# Altium schematic sheet 03.SchDoc (part 12 of 12)

# Altium schematic sheet 03.SchDoc (continued)
size A3; CompanyName (continued): ; Address3: 油平259; Phone: 042-558-0141
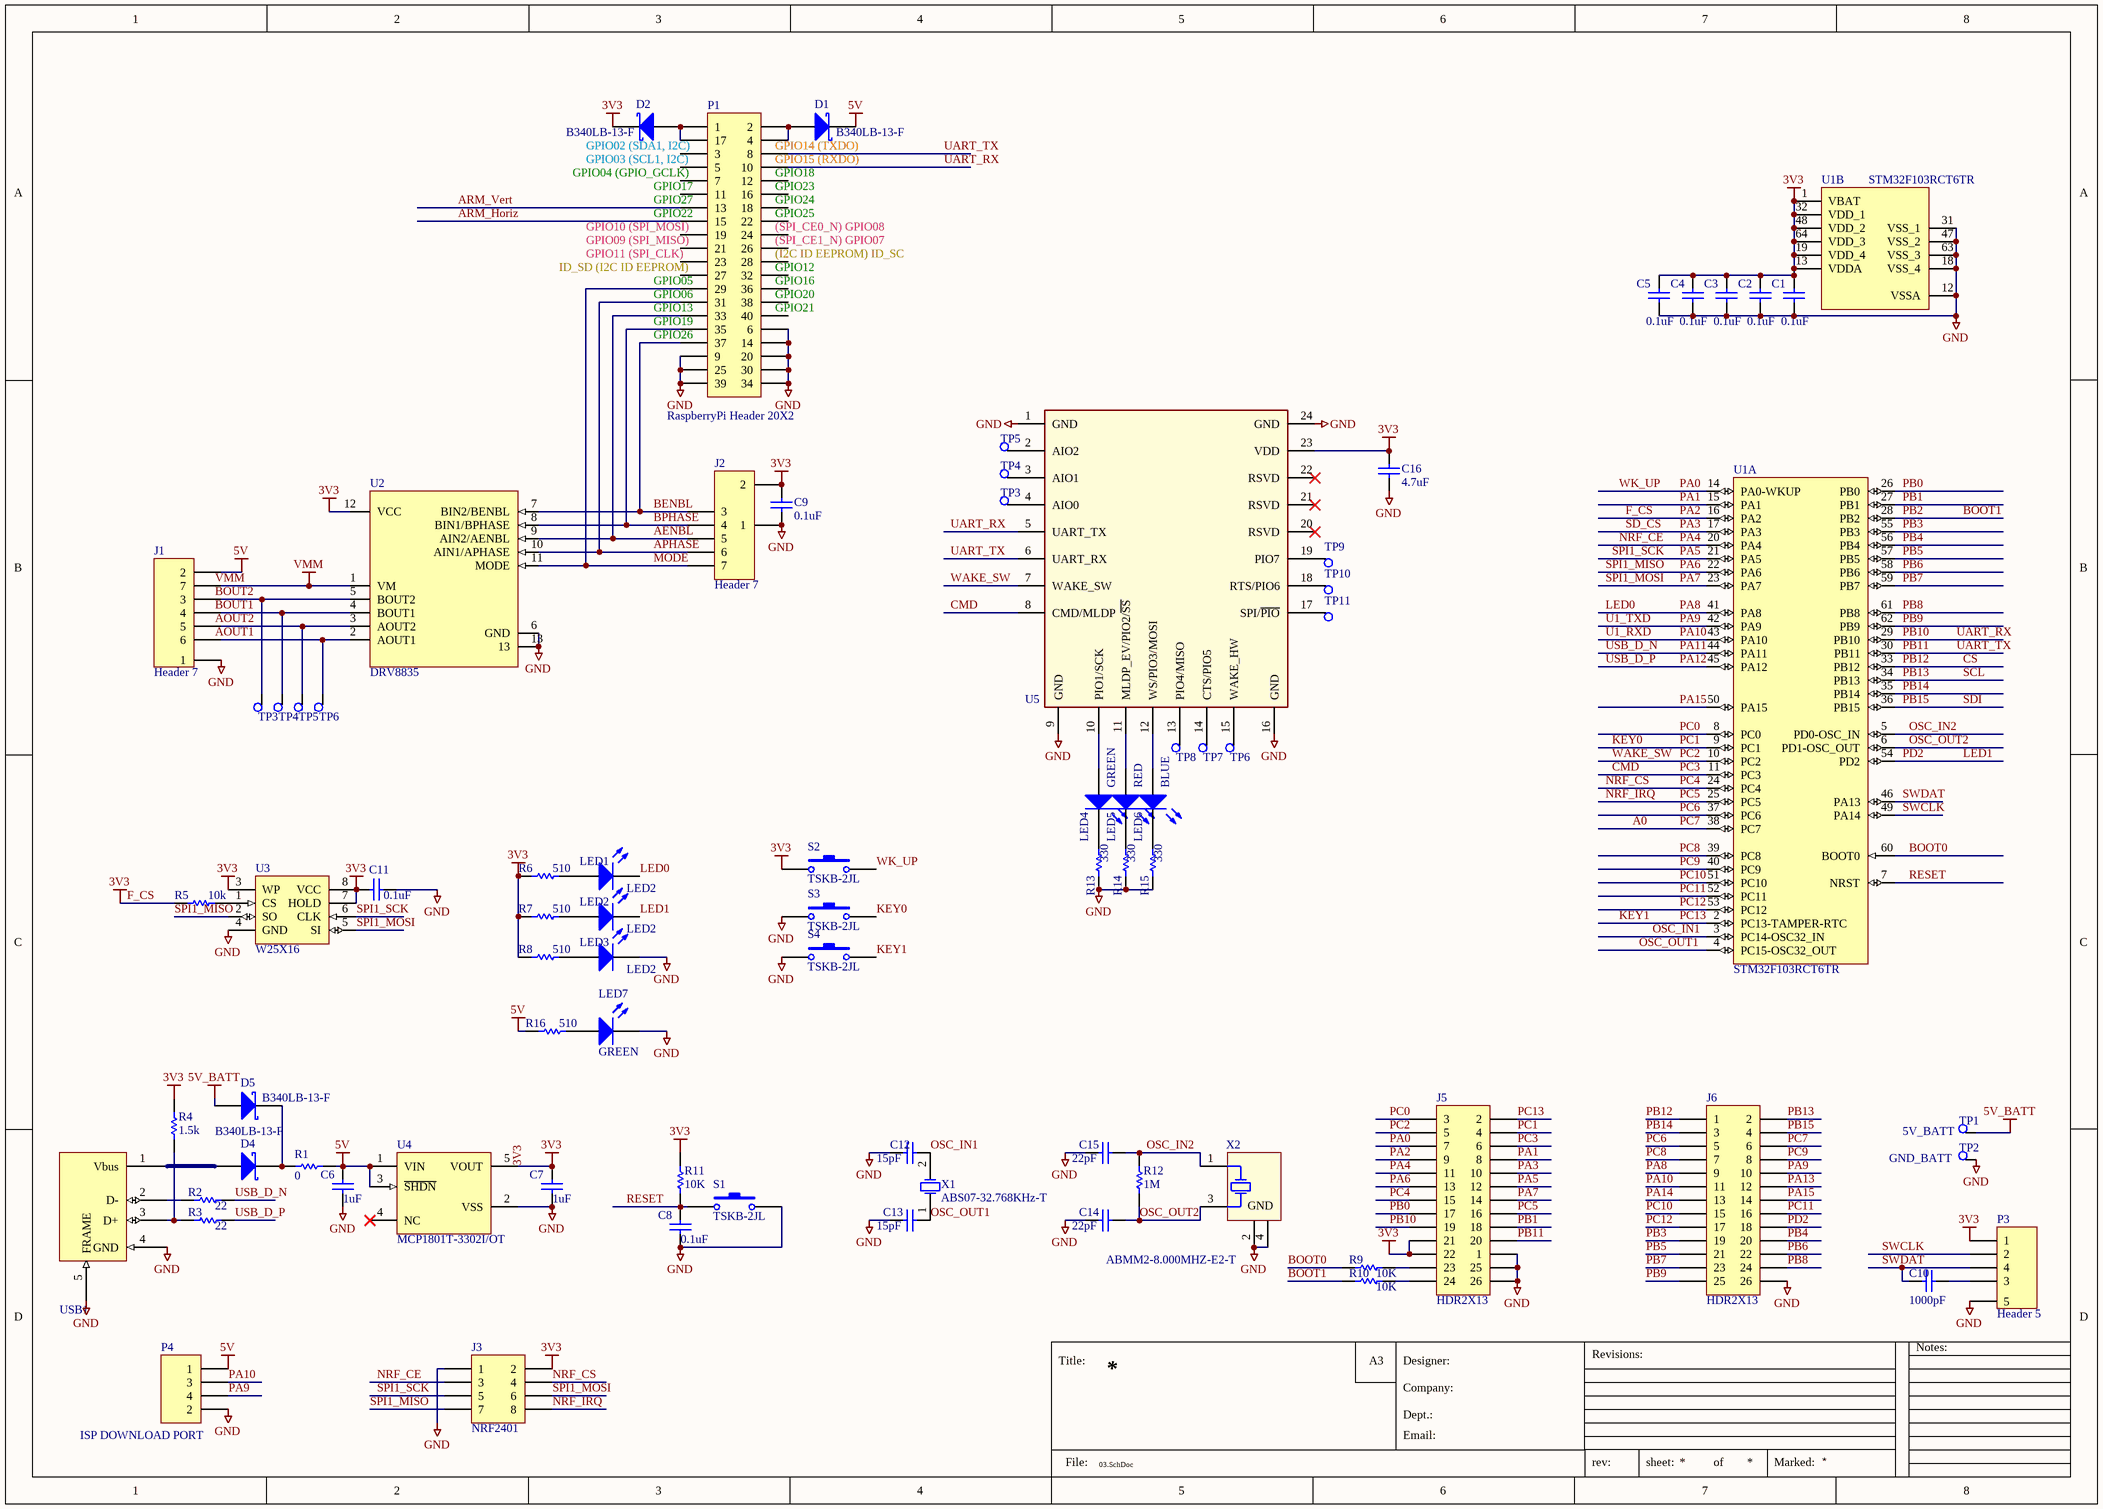
[diagram p0: 03.SchDoc]

## Parts
(Parts that share a designator on the sheet are numbered #1, #2 ... from top to bottom, then left to right.)
C1  0.1uF  [1608[0603]]
C2  0.1uF  [1608[0603]]
C3  0.1uF  [1608[0603]]
C4  0.1uF  [1608[0603]]
C5  0.1uF  [1608[0603]]
C6  1uF  [1608[0603]]
C7  1uF  [1608[0603]]
C8  0.1uF  [1608[0603]]
C9  0.1uF  [1608[0603]]
C10  1000pF  [1608[0603]]
C11  0.1uF  [1608[0603]]
C12  15pF  [1608[0603]]
C13  15pF  [1608[0603]]
C14  22pF  [1608[0603]]
C15  22pF  [1608[0603]]
C16  4.7uF  [1608[0603]]
D1  B340LB-13-F  [DIOM4336X25N]
D2  B340LB-13-F  [DIOM4336X25N]
D4  B340LB-13-F  [DIOM4336X25N]
D5  B340LB-13-F  [DIOM4336X25N]
J1  Header 7  [HDR1X7]
J2  Header 7  [HDR1X7]
J3  NRF2401  [HDR2X4]
J5  HDR2X13  [HDR2X13]
J6  HDR2X13  [HDR2X13]
LED1  LED2  [0603_A]
LED2  LED2  [0603_A]
LED3  LED2  [0603_A]
LED4  GREEN  [0603_A]
LED5  RED  [0603_A]
LED6  BLUE  [0603_A]
LED7  GREEN  [0603_A]
P1  RaspberryPi Header 20X2  [HDR2X20]
P3  Header 5  [HDR1X5]
P4  ISP DOWNLOAD PORT  [HDR1X4]
R1  0  [1608[0603]]
R2  22  [1608[0603]]
R3  22  [1608[0603]]
R4  1.5k  [1608[0603]]
R5  10k  [1608[0603]]
R6  510  [1608[0603]]
R7  510  [1608[0603]]
R8  510  [1608[0603]]
R9  10K  [1608[0603]]
R10  10K  [1608[0603]]
R11  10K  [1608[0603]]
R12  1M  [1608[0603]]
R13  330  [1608[0603]]
R14  330  [1608[0603]]
R15  330  [1608[0603]]
R16  510  [1608[0603]]
S1  TSKB-2JL  [TSKB-2JL]
S2  TSKB-2JL  [TSKB-2JL]
S3  TSKB-2JL  [TSKB-2JL]
S4  TSKB-2JL  [TSKB-2JL]
TP1  5V_BATT  [PAD1]
TP2  GND_BATT  [PAD1]
TP3#1  (no value)  [PAD1]
TP3#2  (no value)  [PAD1]
TP4#1  (no value)  [PAD1]
TP4#2  (no value)  [PAD1]
TP5#1  (no value)  [PAD1]
TP5#2  (no value)  [PAD1]
TP6#1  (no value)  [PAD1]
TP6#2  (no value)  [PAD1]
TP7  (no value)  [PAD1]
TP8  (no value)  [PAD1]
TP9  (no value)  [PAD1]
TP10  (no value)  [PAD1]
TP11  (no value)  [PAD1]
U1  STM32F103RCT6TR  [STM-LQFP64_N]  (parts A,B of 2)
U2  DRV8835
U3  W25X16  [SOIC-SSCODE_SOIC127P790X216-8N]
U4  MCP1801T-3302I/OT  [SOT-23-OT5_M]
U5  RN4020 MODULE-24  [RN4020 MODULE-24]  (value not drawn)
USB1  USB002  [USB/SM0.8-6H5]  (value not drawn)
X1  ABS07-32.768KHz-T  [ABRA-ABS07-2_V]
X2  ABMM2-8.000MHZ-E2-T  [ABRA-ABMM2-4_V]

## Nets
3V3: C1.2 C2.2 C3.2 C4.2 C5.2 C7.2 C9.1 C11.2 C16.1 D2.2(K) J2.2 J3.2 J5.9 J5.21 J5.22 P3.1 R4.1 R5.2 R6.2 R7.2 R8.2 R11.1 S2.1 U1.1(VBAT) U1.13(VDDA) U1.16(PA2) U1.19(VDD_4) U1.32(VDD_1) U1.48(VDD_2) U1.64(VDD_3) U2.12(VCC) U3.3(WP) U3.7(HOLD) U3.8(VCC) U4.5(VOUT) U5.23(VDD)  [also labelled F_CS, PA2]
5V: C6.2 D1.2(K) J1.2 P4.1 R1.1 R16.2 U4.1(VIN) U4.3(~{SHDN})
5V_BATT: D5.1(A) TP1.1
GND: C1.1 C2.1 C3.1 C4.1 C5.1 C6.1 C7.1 C8.1 C9.2 C11.1 C12.2 C13.2 C14.2 C15.2 C16.2 J1.1 J2.1 J3.1 J5.1 J5.25 J5.26 J6.26 LED3.1(K) LED7.1(K) P1.6 P1.9 P1.14 P1.20 P1.25 P1.30 P1.34 P1.39 P3.5 P4.2 R13.2 R14.2 R15.2 S1.2 S3.1 S4.1 TP2.1 U1.12(VSSA) U1.18(VSS_4) U1.31(VSS_1) U1.47(VSS_2) U1.63(VSS_3) U2.6(GND) U2.13 U3.4(GND) U4.2(VSS) U5.1(GND) U5.9(GND) U5.16(GND) U5.24(GND) USB1.4(GND) USB1.5(FRAME) X2.2(GND) X2.4(GND)
VMM: J1.7 U2.1(VM)
A0: J6.6 U1.38(PC7)  [also labelled PC7]
AENBL: J2.5 P1.33 U2.9(AIN2/AENBL)
APHASE: J2.6 P1.31 U2.10(AIN1/APHASE)
ARM_Horiz: P1.15
ARM_Vert: P1.13
BENBL: J2.3 P1.37 U2.7(BIN2/BENBL)
BOOT0: R9.1 U1.60(BOOT0)
BOOT1: R10.1 U1.28(PB2)  [also labelled PB2]
BPHASE: J2.4 P1.35 U2.8(BIN1/BPHASE)
CMD: J5.6 U1.11(PC3) U5.8(CMD/MLDP)  [also labelled PC3]
CS: J6.1 U1.33(PB12)  [also labelled PB12]
KEY0: J5.4 S3.2 U1.9(PC1)  [also labelled PC1]
KEY1: J5.2 S4.2 U1.2(PC13-TAMPER-RTC)  [also labelled PC13]
LED0: J6.9 LED1.1(K) U1.41(PA8)  [also labelled PA8]
LED1: J6.18 LED2.1(K) U1.54(PD2)  [also labelled PD2]
MODE: J2.7 P1.29 U2.11(MODE)
NRF_CE: J3.3 J5.11 U1.20(PA4)  [also labelled PA4]
NRF_CS: J3.4 J5.15 U1.24(PC4)  [also labelled PC4]
NRF_IRQ: J3.8 J5.16 U1.25(PC5)  [also labelled PC5]
OSC_IN1: C12.1 U1.3(PC14-OSC32_IN) X1.2(X2)
OSC_IN2: C15.1 R12.1 U1.5(PD0-OSC_IN) X2.1(X1)
OSC_OUT1: C13.1 U1.4(PC15-OSC32_OUT) X1.1(X1)
OSC_OUT2: C14.1 R12.2 U1.6(PD1-OSC_OUT) X2.3(X2)
PA0: J5.7 S2.2 U1.14(PA0-WKUP)  [also labelled WK_UP]
PA1: J5.8 U1.15(PA1)
PA3: J5.10 U1.17(PA3)  [also labelled SD_CS]
PA5: J3.5 J5.12 U1.21(PA5) U3.6(CLK)  [also labelled SPI1_SCK]
PA6: J3.7 J5.13 U1.22(PA6) U3.2(SO)  [also labelled SPI1_MISO]
PA7: J3.6 J5.14 U1.23(PA7) U3.5(SI)  [also labelled SPI1_MOSI]
PA9: J6.10 P4.4 U1.42(PA9)  [also labelled U1_TXD]
PA10: J6.11 P4.3 U1.43(PA10)  [also labelled U1_RXD]
PA11: R2.1 U1.44(PA11)  [also labelled USB_D_N]
PA12: R3.1 U1.45(PA12)  [also labelled USB_D_P]
PA13: J6.12
PA14: J6.13
PA15: J6.14 U1.50(PA15)
PB0: J5.17 U1.26(PB0)
PB1: J5.18 U1.27(PB1)
PB3: J6.19 U1.55(PB3)
PB4: J6.20 U1.56(PB4)
PB5: J6.21 U1.57(PB5)
PB6: J6.22 U1.58(PB6)
PB7: J6.23 U1.59(PB7)
PB8: J6.24 U1.61(PB8)
PB9: J6.25 U1.62(PB9)
PB10: J5.19 P1.10 U1.29(PB10) U5.5(UART_TX)  [also labelled UART_RX]
PB11: J5.20 P1.8 U1.30(PB11) U5.6(UART_RX)  [also labelled UART_TX]
PB13: J6.2 U1.34(PB13)  [also labelled SCL]
PB14: J6.3 U1.35(PB14)
PB15: J6.4 U1.36(PB15)  [also labelled SDI]
PC0: J5.3 U1.8(PC0)
PC2: J5.5 U1.10(PC2) U5.7(WAKE_SW)  [also labelled WAKE_SW]
PC6: J6.5 U1.37(PC6)
PC8: J6.7 U1.39(PC8)
PC9: J6.8 U1.40(PC9)
PC10: J6.15 U1.51(PC10)
PC11: J6.16 U1.52(PC11)
PC12: J6.17 U1.53(PC12)
RESET: C8.2 R11.2 S1.1 U1.7(NRST)
SWCLK: P3.2 U1.49(PA14)
SWDAT: C10.1 P3.4 U1.46(PA13)
NetC10_2: C10.2 P3.3
NetD1_1: D1.1(A) P1.2 P1.4
NetD2_1: D2.1(A) P1.1 P1.17
NetD4_1: D4.1(A) USB1.1(Vbus)
NetD4_2: D4.2(K) D5.2(K) R1.2
NetJ1_3: J1.3 TP3#2.1 U2.5(BOUT2)
NetJ1_4: J1.4 TP4#2.1 U2.4(BOUT1)
NetJ1_5: J1.5 TP5#2.1 U2.3(AOUT2)
NetJ1_6: J1.6 TP6#1.1 U2.2(AOUT1)
NetJ5_23: J5.23 R9.2
NetJ5_24: J5.24 R10.2
NetLED1_2: LED1.2(A) R6.1
NetLED2_2: LED2.2(A) R7.1
NetLED3_2: LED3.2(A) R8.1
NetLED4_1: LED4.1(K) R13.1
NetLED4_2: LED4.2(A) U5.10(PIO1/SCK)
NetLED5_1: LED5.1(K) R14.1
NetLED5_2: LED5.2(A) U5.11(MLDP_EV/PIO2/~{SS})
NetLED6_1: LED6.1(K) R15.1
NetLED6_2: LED6.2(A) U5.12(WS/PIO3/MOSI)
NetR2_2: R2.2 USB1.2(D-)
NetR3_2: R3.2 R4.2 USB1.3(D+)
NetR5_1: R5.1 U3.1(CS)
NetTP3#1_1: TP3#1.1 U5.4(AIO0)
NetTP4#1_1: TP4#1.1 U5.3(AIO1)
NetTP5#1_1: TP5#1.1 U5.2(AIO2)
NetTP6#2_1: TP6#2.1 U5.15(WAKE_HW)
NetTP7_1: TP7.1 U5.14(CTS/PIO5)
NetTP8_1: TP8.1 U5.13(PIO4/MISO)
NetTP9_1: TP9.1 U5.19(PIO7)
NetTP10_1: TP10.1 U5.18(RTS/PIO6)
NetTP11_1: TP11.1 U5.17(SPI/~{PIO})

Not connected (* = marked no-connect by the designer): LED7 2(A); P1 3 5 7 11 12 16 18 19 21 22 23 24 26 27 28 32 36 38 40; R16 1; U4 4(NC)*; U5 20(RSVD)* 21(RSVD)* 22(RSVD)*

## Notes on the sheet
- GPIO04 (GPIO_GCLK)
- GPIO02 (SDA1, I2C)
- (near P1) GPIO03 (SCL1, I2C)
- GPIO14 (TXDO)
- (near P1) GPIO15 (RXDO)
- (near P1) GPIO18
- (near P1) GPIO09 (SPI_MISO)
- (near P1) GPIO10 (SPI_MOSI)
- (near P1) GPIO17
- (near P1) GPIO22
- (near P1) GPIO27
- (near P1) (SPI_CE1_N) GPIO07
- (near P1) (SPI_CE0_N) GPIO08
- (near P1) GPIO23
- (near P1) GPIO24
- (near P1) GPIO25
- (near P1) ID_SD (I2C ID EEPROM)
- (near P1) GPIO11 (SPI_CLK)
- (near P1) GPIO05
- (near P1) GPIO06
- (near P1) GPIO13
- (near P1) GPIO12
- (near P1) GPIO16
- (near P1) GPIO20
- (near P1) GPIO21
- (near P1) (I2C ID EEPROM) ID_SC
- (near P1) GPIO19
- (near P1) GPIO26
- Labels drawn without touching a wire or pin: AOUT1, AOUT2, BOUT1, BOUT2, VMM
- Title:
- A3
- Designer:
- Company:
- Revisions:
- Notes:
- Dept.:
- Email:
- File:
- rev:
- sheet:
- of
- Marked:

## Library data of the parts
C1-C16 = Cap: Capacitor; Published: 8-Jun-2000; LatestRevisionDate: 17-Jul-2002; LatestRevisionNote: Re-released for DXP Platform.; PackageReference: RAD-0.3; Publisher: Altium Limited; PackageDescription: Radial Cap, Thru-Hole; 2 Leads; 0.3 in Pin Spacing
  C1-C5 C8 C9 C11: Value: 0.1uF
  C6 C7: Value: 1uF
  C10: Value: 1000pF
  C12 C13: Value: 15pF
  C14 C15: Value: 22pF
  C16: Value: 4.7uF
D1 D2 D4 D5 = D Schottky: Schottky Diode; OTHER: SX34F @20; LatestRevisionDate: 17-Jul-2002; LatestRevisionNote: Re-released for DXP Platform.; PackageReference: SMB; Publisher: Altium Limited; Code_JEDEC: DO-214-AA
J1 J2 = Header 7: Header, 7-Pin; LatestRevisionDate: 17-Jul-2002; LatestRevisionNote: Re-released for DXP Platform.; Publisher: Altium Limited
J3 = Header 4X2: Header, 4-Pin, Dual row; LatestRevisionDate: 17-Jul-2002; LatestRevisionNote: Re-released for DXP Platform.; Publisher: Altium Limited
J5 J6 = MHDR2X13: Header, 13-Pin, Dual row; LatestRevisionDate: 17-Jul-2002; LatestRevisionNote: Re-released for DXP Platform.; Publisher: Altium Limited
LED1-LED7 = LED2: Typical RED, GREEN, YELLOW, AMBER GaAs LED; Published: 8-Jun-2000; LatestRevisionDate: 17-Jul-2002; LatestRevisionNote: Re-released for DXP Platform.; PackageVersion: Feb-2002; PackageReference: 3.2X1.6X1.1; Publisher: Altium Limited; PackageDescription: SM LED; 2 Flat Leads
P1 = Header 20X2: Header, 20-Pin, Dual row; LatestRevisionDate: 17-Jul-2002; LatestRevisionNote: Re-released for DXP Platform.; Publisher: Altium Limited
P3 = Header 5: Header, 5-Pin; LatestRevisionDate: 17-Jul-2002; LatestRevisionNote: Re-released for DXP Platform.; Publisher: Altium Limited
P4 = Header 4: Header, 4-Pin; LatestRevisionDate: 17-Jul-2002; LatestRevisionNote: Re-released for DXP Platform.; Publisher: Altium Limited
R1-R16 = Res1: Resistor; PARTS: AH-50W 10R; PRICE: 350; LatestRevisionDate: 17-Jul-2002; LatestRevisionNote: Re-released for DXP Platform.; PackageReference: AXIAL-0.3
  R1: Value: 0
  R2 R3: Value: 22
  R4: Value: 1.5k
  R5: Value: 10k
  R6-R8 R16: Value: 510
  R9-R11: Value: 10K
  R12: Value: 1M
  R13-R15: Value: 330
S1-S4 = SW-PB: Switch; Published: 24-Mar-1999; LatestRevisionDate: 17-Jul-2002; LatestRevisionNote: Re-released for DXP Platform.; PackageReference: SPST-2; Publisher: Altium Limited; PackageDescription: Switch; 2 Leads
TP1 TP2 TP3#1 TP3#2 TP4#1 TP4#2 TP5#1 TP5#2 TP6#1 TP6#2 TP7-TP11 = RAUND1
U1 = CMP-0237-00202-3: ARM Cortex-M3 32-bit MCU, 256 KB Flash, 48 KB Internal RAM, 51 I/Os, 64-pin LQFP, -40 to 85 degC, Tape and Reel; FLASH Size (Prog) (kB): 256; D/A Converter: 2x12-bit (2 Channel); Operating Frequency(F) (Processor speed) (MHz): 72; Internal RAM Size (kB): 48; I/Os (High Current): 51; A/D Converter: 3x12-bit (16 Channel); Supply Voltage(Vcc) min (V): 2; ComponentLink1Description: Manufacturer URL; ComponentLink2Description: Datasheet; ComponentLink3URL: http://www.st.com/st-web-ui/static/active/en/resource/technical/document/datasheet/DM00037051.pdf; ComponentLink2URL: http://www.st.com/st-web-ui/static/active/en/resource/technical/document/datasheet/CD00191185.pdf; PackageDescription: 64-Pin Low Profile Quad Flat Package, 10 x 10 mm Body, 0.5 mm Pitch; ComponentLink3Description: Package Specification; PackageReference: LQFP64; Core: ARM Cortex-M3; PartNumber: STM32F103RCT6TR; Mounting Technology: Surface Mount; ComponentLink1URL: http://www.st.com/web/en/home.html; Packing: Tape and Reel; DatasheetVersion: Rev. 8; PackageVersion: Rev. 4, 06/2013; PartId: 1
U4 = CMP-0136-00719-1: 150 mA, High PSRR, Low Quiescent Current LDO, 5-Pin SOT-23, Industrial Temperature, Tape and Reel; Code_IPC: SOT23-5; PackageVersion: revBB, Aug-2009; PackageReference: SOT-23-OT5; DatasheetVersion: revC, Jan-2009; PackageDescription: 5-Lead Plastic Small Outline Transistor (OT) [SOT-23]
X1 = CMP-0447-00001-2: Crystal, 32.768 kHz, 12.5 pF, -40 to 85 degC, SMD Low Profile 3.2 x 1.5 x 0.9 mm, Tape and Reel; Manufacturer: Abracon; Q Value (Type): 30000; Operation Mode: Flexural Mode (Tuning Fork); Shunt Capacitance (C0): 0.9 to 1.2 pF; Load Capacitance (CL): 12.5 pF; Frequency Tolerance @+25degC: +/- 20 ppm; Drive Level (Type): 0.1 uW; Equivalent Series Resistance (R1): 70 Kohm; Insulation Resistance (Min): 500 Mohm; ComponentLink3URL: http://www.abracon.com/Resonators/ABS07.pdf; PackageDescription: 2-Pin Hand Drawn, Body 3.2x1.5mm, Pitch 2.5mm; Operating Temperature: -40 to 85 degC; ComponentLink2URL: http://www.abracon.com/Resonators/ABS07.pdf; PackageReference: ABS07-2; ComponentLink3Description: Package Specification; ComponentLink1Description: Manufacturer URL; DatasheetVersion: 04.03.13; Mounting Technology: Surface Mount; ComponentLink2Description: Datasheet; ComponentLink1URL: http://www.abracon.com/; PartNumber: ABS07-32.768KHz-T; Packing: Tape and Reel; Frequency: 32.768 kHz
X2 = CMP-0277-00003-1: Ceramic Surface Mount Low Profile Quartz Crystal, 8 MHz, -20 to 70 degC, 4-Pin 6 x 3.6 x 1.2 mm SMD, RoHS, 1000pcs / Reel; Manufacturer: Abracon; ESR: 72 Ohm Max.; Frequency: 8 MHz; Shunt Capacitance C0: 7 pF Max.; Load Capacitance CL: 18 pF Typ.; ComponentLink3Description: Package Specification; PackageDescription: 4-Pin SMD, Body 6 x 3.6 mm, Pitch 4.4 mm; DatasheetVersion: Jan-13; ComponentLink1URL: http://www.abracon.com/; ComponentLink2URL: http://www.abracon.com/Resonators/ABMM2.pdf; Temperature Range: -20 to 70 degC; Mounting Technology: Surface Mount; RoHS: TRUE; PartNumber: ABMM2-8.000MHZ-E2-T; ComponentLink2Description: Datasheet; ComponentLink3URL: http://www.abracon.com/Resonators/ABMM2.pdf; ComponentLink1Description: Manufacturer URL; Packing: 1000pcs / Reel